# EAGLE design io-serial (EAGLE 5.10)
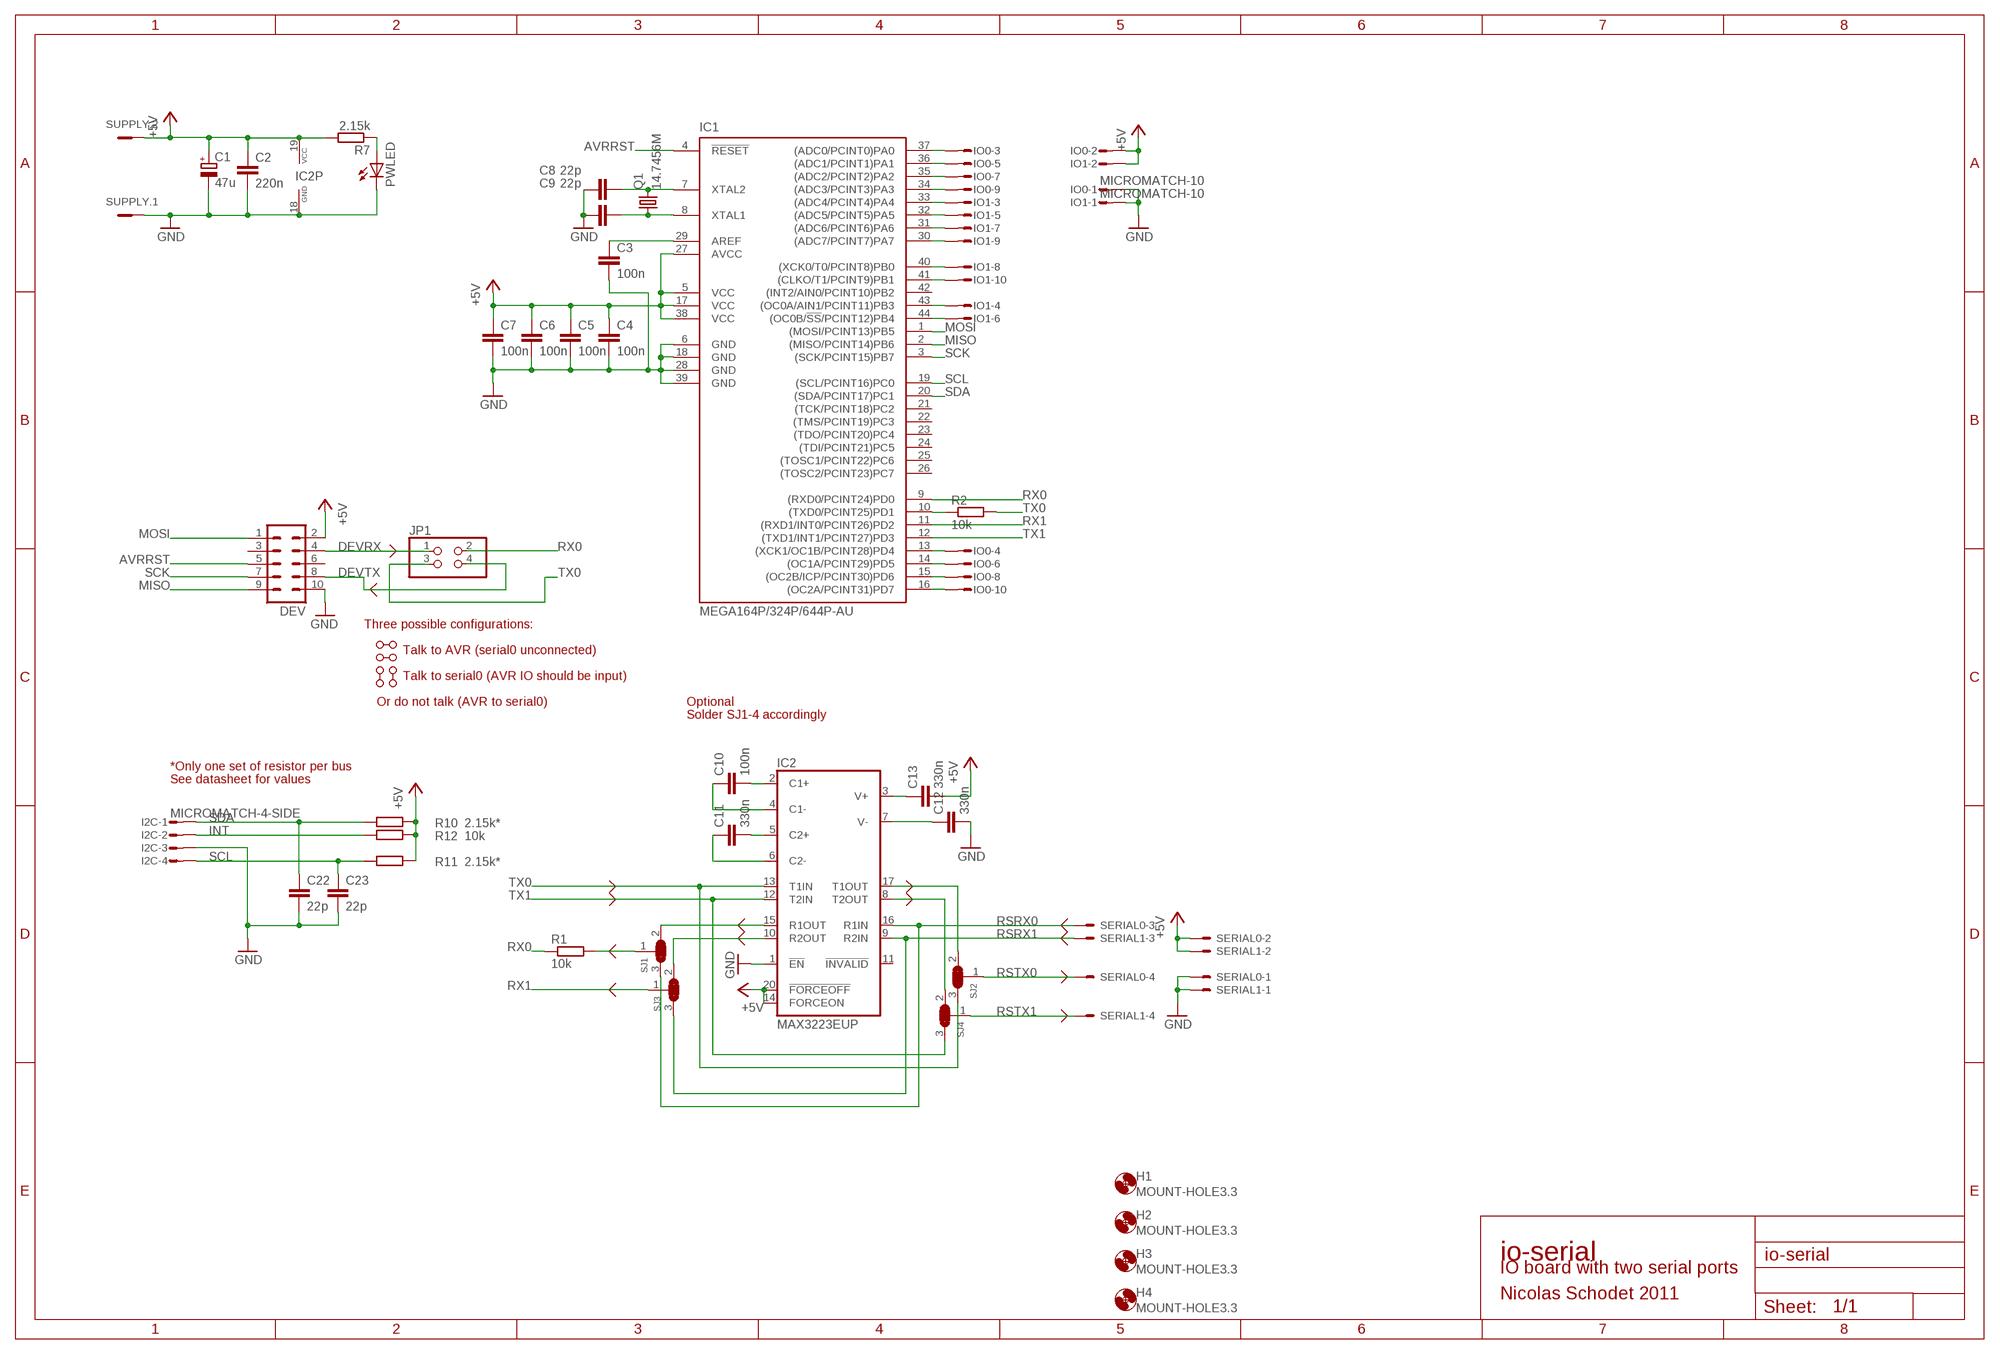
[diagram p0: schematic, sheet 1]

## Parts
C1  47u  CPOL-EUC  [PANASONIC_C]
C2  220n  C-EUC0603  [C0603]
C3  100n  C-EUC0603  [C0603]
C4  100n  C-EUC0603  [C0603]
C5  100n  C-EUC0603  [C0603]
C6  100n  C-EUC0603  [C0603]
C7  100n  C-EUC0603  [C0603]
C8  22p  C-EUC0603  [C0603]
C9  22p  C-EUC0603  [C0603]
C10  100n  C-EUC0603  [C0603]
C11  330n  C-EUC0603  [C0603]
C12  330n  C-EUC0603  [C0603]
C13  330n  C-EUC0603  [C0603]
C22  22p  C-EUC0603  [C0603]
C23  22p  C-EUC0603  [C0603]
DEV  ML10L  [ML10L]
H1  MOUNT-HOLE3.3  [3,3]
H2  MOUNT-HOLE3.3  [3,3]
H3  MOUNT-HOLE3.3  [3,3]
H4  MOUNT-HOLE3.3  [3,3]
I2C  MICROMATCH-4-SIDE  [MICROMATCH-4-SIDE]
IC1  MEGA164P/324P/644P-AU  [TQFP44]
IC2  MAX3223EUP  [TSSOP20]
IO0  MICROMATCH-10  [MICROMATCH-10]
IO1  MICROMATCH-10  [MICROMATCH-10]
JP1  PINHD-2X2  [2X02]
PWLED  LEDSMT1206  [1206]
Q1  14.7456M  CRYSTALHC49U70  [HC49U70]
R1  10k  R-EU_R0603  [R0603]
R2  10k  R-EU_R0603  [R0603]
R7  2.15k  R-EU_R0603  [R0603]
R10  2.15k*  R-EU_R0603  [R0603]
R11  2.15k*  R-EU_R0603  [R0603]
R12  10k  R-EU_R0603  [R0603]
SERIAL0  EC1X04  [EC1X04]
SERIAL1  EC1X04  [EC1X04]
SJ1  SJ2SMD  [SJ2-SMD]
SJ2  SJ2SMD  [SJ2-SMD]
SJ3  SJ2SMD  [SJ2-SMD]
SJ4  SJ2SMD  [SJ2-SMD]
SUPPLY  MC2  [MC2]

## Nets
+5V [supply]: C1.+ C2.1 C4.1 C5.1 C6.1 C7.1 C13.2 DEV.2 IC1.5(VCC) IC1.17(VCC) IC1.27(AVCC) IC1.38(VCC) IC2.14(FORCEON) IC2.19(VCC) IC2.20(!FORCEOFF) IO0.2 IO1.2 R7.2 R10.2 R11.2 R12.2 SERIAL0.2 SERIAL1.2 SUPPLY.2
A0: IC1.37((ADC0/PCINT0)PA0) IO0.3
A1: IC1.36((ADC1/PCINT1)PA1) IO0.5
A2: IC1.35((ADC2/PCINT2)PA2) IO0.7
A3: IC1.34((ADC3/PCINT3)PA3) IO0.9
A4: IC1.33((ADC4/PCINT4)PA4) IO1.3
A5: IC1.32((ADC5/PCINT5)PA5) IO1.5
A6: IC1.31((ADC6/PCINT6)PA6) IO1.7
A7: IC1.30((ADC7/PCINT7)PA7) IO1.9
AREF: C3.1 IC1.29(AREF)
AVRCLK: C8.2 IC1.7(XTAL2) Q1.2
AVRRST: DEV.5 IC1.4(!RESET)
D4: IC1.13((XCK1/OC1B/PCINT28)PD4) IO0.4
D5: IC1.14((OC1A/PCINT29)PD5) IO0.6
D6: IC1.15((OC2B/ICP/PCINT30)PD6) IO0.8
D7: IC1.16((OC2A/PCINT31)PD7) IO0.10
DEVRX: DEV.4 JP1.1
DEVTX: DEV.8 JP1.4
GND [supply]: C1.- C2.2 C3.2 C4.2 C5.2 C6.2 C7.2 C8.1 C9.1 C12.2 C22.2 C23.2 DEV.10 I2C.3 IC1.6(GND) IC1.18(GND) IC1.28(GND) IC1.39(GND) IC2.1(!EN) IC2.18(GND) IO0.1 IO1.1 PWLED.C SERIAL0.1 SERIAL1.1 SUPPLY.1
INT: I2C.2 R12.1
MAXRX0: IC2.15(R1OUT) SJ1.2
MAXRX1: IC2.10(R2OUT) SJ3.2
MAXTX0: IC2.17(T1OUT) SJ2.2
MAXTX1: IC2.8(T2OUT) SJ4.2
MC1+: C10.2 IC2.2(C1+)
MC1-: C10.1 IC2.4(C1-)
MC2+: C11.2 IC2.5(C2+)
MC2-: C11.1 IC2.6(C2-)
MISO: DEV.9 IC1.2((MISO/PCINT14)PB6)
MOSI: DEV.1 IC1.1((MOSI/PCINT13)PB5)
MV+: C13.1 IC2.3(V+)
MV-: C12.1 IC2.7(V-)
NPWLED: PWLED.A R7.1
PB0: IC1.40((XCK0/T0/PCINT8)PB0) IO1.8
PB1: IC1.41((CLKO/T1/PCINT9)PB1) IO1.10
PB3: IC1.43((OC0A/AIN1/PCINT11)PB3) IO1.4
PB4: IC1.44((OC0B/!SS!/PCINT12)PB4) IO1.6
RSRX0: IC2.16(R1IN) SERIAL0.3 SJ1.3
RSRX1: IC2.9(R2IN) SERIAL1.3 SJ3.3
RSTX0: SERIAL0.4 SJ2.1
RSTX1: SERIAL1.4 SJ4.1
RX0: IC1.9((RXD0/PCINT24)PD0) JP1.2 R1.1
RX0R: R1.2 SJ1.1
RX1: IC1.11((RXD1/INT0/PCINT26)PD2) SJ3.1
SCK: DEV.7 IC1.3((SCK/PCINT15)PB7)
SCL: C23.1 I2C.4 IC1.19((SCL/PCINT16)PC0) R11.1
SDA: C22.1 I2C.1 IC1.20((SDA/PCINT17)PC1) R10.1
TX0: IC2.13(T1IN) JP1.3 R2.2 SJ2.3
TX0R: IC1.10((TXD0/PCINT25)PD1) R2.1
TX1: IC1.12((TXD1/INT1/PCINT27)PD3) IC2.12(T2IN) SJ4.3
XTAL1: C9.2 IC1.8(XTAL1) Q1.1
Unconnected: DEV.3 DEV.6 IC1.21((TCK/PCINT18)PC2) IC1.22((TMS/PCINT19)PC3) IC1.23((TDO/PCINT20)PC4) IC1.24((TDI/PCINT21)PC5) IC1.25((TOSC1/PCINT22)PC6) IC1.26((TOSC2/PCINT23)PC7) IC1.42((INT2/AIN0/PCINT10)PB2) IC2.11(!INVALID)

## Notes on the sheet
- Three possible configurations:
- Talk to AVR (serial0 unconnected)
- Talk to serial0 (AVR IO should be input)
- Or do not talk (AVR to serial0) | Optional
- Solder SJ1-4 accordingly
- *Only one set of resistor per bus
- See datasheet for values
- io-serial
- IO board with two serial ports
- Nicolas Schodet 2011

## Library data of the parts
C1 = rcl:CPOL-EU: POLARIZED CAPACITOR, European symbol
C2-C13 C22 C23 = rcl:C-EU: CAPACITOR, European symbol
DEV = con-harting-ml:ML10: HARTING
H1-H4 = holes:MOUNT-HOLE: MOUNTING HOLE with drill center marker
I2C = apbteam_con-amp-micromatch:MICROMATCH-4: MicroMaTch 4
IC1 = avr-5:MEGA164P/324P/644P-AU
IC2 = maxim:MAX3223*: RS-232 Transceivers with AutoShutdown 1µA Supply-Current, True +3V to +5.5V http://dbserv.maxim-ic.com/
IO0 IO1 = apbteam_con-amp-micromatch:MICROMATCH-10: MicroMaTch 10
JP1 = pinhead:PINHD-2X2: PIN HEADER
PWLED = led:LED: LED OSRAM: - CHIPLED LG R971, LG N971, LY N971, LG Q971, LY Q971, LO R971, LY R971 LH N974, LH R974 LS Q976, LO Q976, LY Q976 LO Q996 - Hyper CHIPLED LW Q18S LB Q993, LB Q99A, LB R99A - SideLED LS A670, LO A670, LY A670, LG A670, LP A670 LB A673, LV A673, LT A673, LW A673 LH A674 LY A675 LS A676, LA A676, LO A676, LY A676, LW A676 LS A679, LY A679, LG A679 - Hyper Micro SIDELED® LS Y876, LA Y876, LO Y876, LY Y876 LT Y87S - SmartLED LW L88C, LW L88S LB L89C, LB L89S, LG L890 LS L89K, LO L89K, LY L89K LS L896, LA L896, LO L896, LY L896 - TOPLED LS T670, LO T670, LY T670, LG T670, LP T670 LSG T670, LSP T670, LSY T670, LOP T670, LYG T670 LG T671, LOG T671, LSG T671 LB T673, LV T673, LT T673, LW T673 LH T674 LS T676, LA T676, LO T676, LY T676, LB T676, LH T676, LSB T676, LW T676 LB T67C, LV T67C, LT T67C, LS T67K, LO T67K, LY T67K, LW E67C LS E67B, LA E67B, LO E67B, LY E67B, LB E67C, LV E67C, LT E67C LW T67C LS T679, LY T679, LG T679 LS T770, LO T770, LY T770, LG T770, LP T770 LB T773, LV T773, LT T773, LW T773 LH T774 LS E675, LA E675, LY E675, LS T675 LS T776, LA T776, LO T776, LY T776, LB T776 LHGB T686 LT T68C, LB T68C - Hyper Mini TOPLED® LB M676 - Mini TOPLED Santana® LG M470 LS M47K, LO M47K, LY M47K Source: http://www.osram.convergy.de LUXEON: - LUMILED® LXK2-PW12-R00, LXK2-PW12-S00, LXK2-PW14-U00, LXK2-PW14-V00 LXK2-PM12-R00, LXK2-PM12-S00, LXK2-PM14-U00 LXK2-PE12-Q00, LXK2-PE12-R00, LXK2-PE12-S00, LXK2-PE14-T00, LXK2-PE14-U00 LXK2-PB12-K00, LXK2-PB12-L00, LXK2-PB12-M00, LXK2-PB14-N00, LXK2-PB14-P00, LXK2-PB14-Q00 LXK2-PR12-L00, LXK2-PR12-M00, LXK2-PR14-Q00, LXK2-PR14-R00 LXK2-PD12-Q00, LXK2-PD12-R00, LXK2-PD12-S00 LXK2-PH12-R00, LXK2-PH12-S00 LXK2-PL12-P00, LXK2-PL12-Q00, LXK2-PL12-R00 Source: www.luxeon.com KINGBRIGHT: KA-3528ASYC Source: www.kingbright.com
Q1 = crystal:CRYSTAL: CRYSTAL
R1 R2 R7 R10-R12 = rcl:R-EU_: RESISTOR, European symbol
SERIAL0 SERIAL1 = apbteam_con-amp-he14:E?1X04: Male header simple row, 4 positions
SJ1-SJ4 = apbteam_jumper:SJ2: Jumper, 3 ways
SUPPLY = con-phoenix-381_l:MC2: Mini-Combicon 3.81mm horizontal 2-polig MC 1,5/2-G-3,81 Artikel-Nr. 1803277

## Net classes
1 supply: width 0.254 mm

## Board
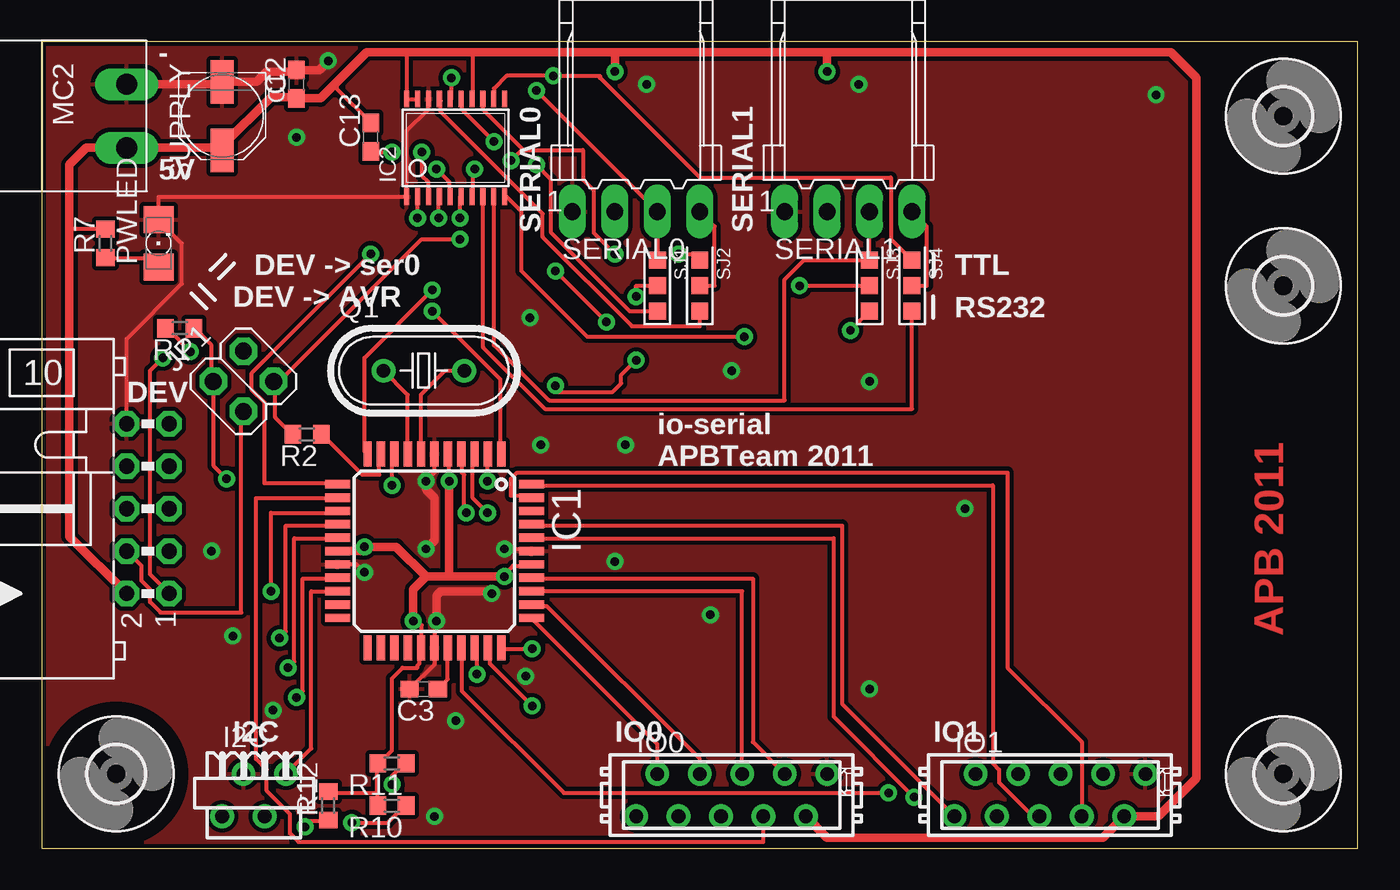
[diagram p1: board, top side]
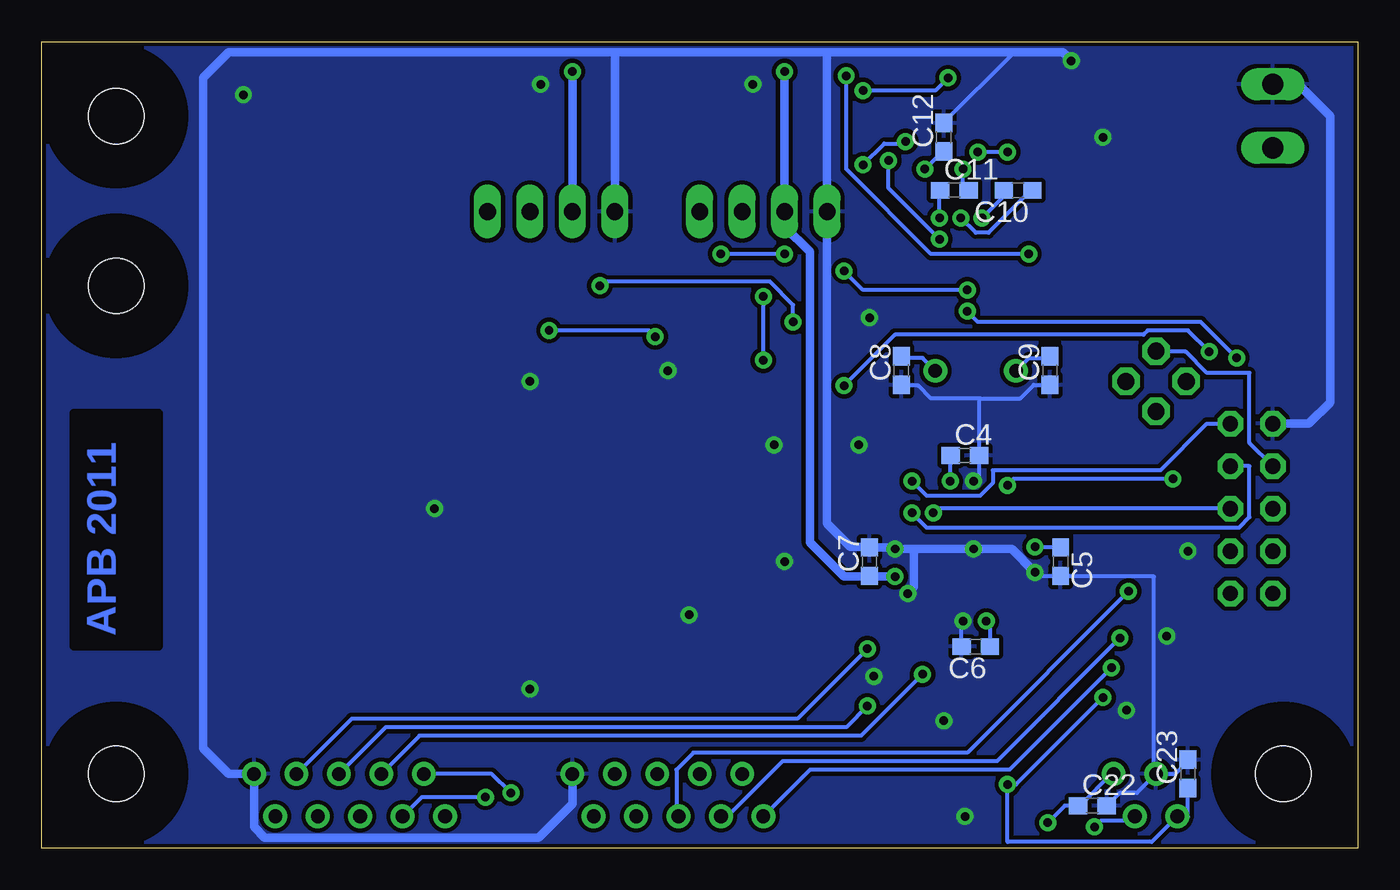
[diagram p2: board, bottom side, seen from below]

Size 78.74 x 48.26 mm. Coordinates in mm from the lower left corner, seen from the top.
Outline: 0,0 78.74,0 78.74,48.26 0,48.26 0,0
Copper layers (1*16): Top 0.035mm / dielectric 1.5mm / Bottom 0.035mm
Design rules "SparkFun *": minimum track width 10mil, minimum drill 20mil, track to track 10mil, track to pad 10mil, pad to pad 10mil, via to via 10mil, smd to smd 10mil, copper to edge 10mil, drill to drill 10mil, minimum pad ring 12mil, minimum via ring 10mil, stop-mask expansion 4mil, vias tented up to drill 25mil, thermal gap 10mil
bRestrict: area 71.8,12.1 to 76.8,26

### Footprints (pad centres in the part's own frame; a part is rotated, then mirrored left to right if it is on the bottom)
PANASONIC_C = smd 2.6 x 1.4: + 2.05,0; - -2.05,0
C0603 = smd 1.1 x 1: 1 -0.85,0; 2 0.85,0
ML10L = drill 0.914 octagon: 1 -5.08,-1.27; 2 -5.08,1.27; 3 -2.54,-1.27; 4 -2.54,1.27; 5 0,-1.27; 6 0,1.27; 7 2.54,-1.27; 8 2.54,1.27; 9 5.08,-1.27; 10 5.08,1.27
3,3 = hole 3.3: 0,0
MICROMATCH-4-SIDE = drill 0.813 round: 1 1.905,1.27; 2 0.635,-1.27; 3 -0.635,1.27; 4 -1.905,-1.27
TQFP44 = smd 1.5 x 0.5: 1 -5.8,4; 2 -5.8,3.2; 3 -5.8,2.4; 4 -5.8,1.6; 5 -5.8,0.8; 6 -5.8,0; 7 -5.8,-0.8; 8 -5.8,-1.6; 9 -5.8,-2.4; 10 -5.8,-3.2; 11 -5.8,-4; 23 5.8,-4; 24 5.8,-3.2; 25 5.8,-2.4; 26 5.8,-1.6; 27 5.8,-0.8; 28 5.8,0; 29 5.8,0.8; 30 5.8,1.6; 31 5.8,2.4; 32 5.8,3.2; 33 5.8,4 | smd 0.5 x 1.5: 12 -4,-5.8; 13 -3.2,-5.8; 14 -2.4,-5.8; 15 -1.6,-5.8; 16 -0.8,-5.8; 17 0,-5.8; 18 0.8,-5.8; 19 1.6,-5.8; 20 2.4,-5.8; 21 3.2,-5.8; 22 4,-5.8; 34 4,5.8; 35 3.2,5.8; 36 2.4,5.8; 37 1.6,5.8; 38 0.8,5.8; 39 0,5.8; 40 -0.8,5.8; 41 -1.6,5.8; 42 -2.4,5.8; 43 -3.2,5.8; 44 -4,5.8
TSSOP20 = smd 0.305 x 0.991: 1 -2.925,-2.918; 2 -2.275,-2.918; 3 -1.625,-2.918; 4 -0.975,-2.918; 5 -0.325,-2.918; 6 0.325,-2.918; 7 0.975,-2.918; 8 1.625,-2.918; 9 2.275,-2.918; 10 2.925,-2.918; 11 2.925,2.918; 12 2.275,2.918; 13 1.625,2.918; 14 0.975,2.918; 15 0.325,2.918; 16 -0.325,2.918; 17 -0.975,2.918; 18 -1.625,2.918; 19 -2.275,2.918; 20 -2.925,2.918
MICROMATCH-10 = drill 0.813 round: 1 5.715,1.27; 2 4.445,-1.27; 3 3.175,1.27; 4 1.905,-1.27; 5 0.635,1.27; 6 -0.635,-1.27; 7 -1.905,1.27; 8 -3.175,-1.27; 9 -4.445,1.27; 10 -5.715,-1.27
2X02 = drill 1.016 octagon: 1 -1.27,-1.27; 2 -1.27,1.27; 3 1.27,-1.27; 4 1.27,1.27
1206 = smd 1.6 x 1.803: A -1.422,0; C 1.422,0
HC49U70 = drill 0.813 round: 1 -2.413,0; 2 2.413,0
R0603 = smd 1 x 1.1: 1 -0.85,0; 2 0.85,0
EC1X04 = drill 1 long: 1 -3.81,0; 2 -1.27,0; 3 1.27,0; 4 3.81,0
SJ2-SMD = smd 1.016 x 1.016: 1 0,0; 2 -1.524,0; 3 1.524,0
MC2 = drill 1.27 long: 1 -1.905,0; 2 1.905,0

### Placement (x,y rotation side)
C1  10.79,43.81 270 top
C2  15.24,45.72 90 top
C3  22.86,9.53 180 top
C4  23.5,23.5 0 bottom
C5  17.78,17.14 270 bottom
C6  22.86,12.06 180 bottom
C7  29.21,17.14 90 bottom
C8  27.3,28.57 90 bottom
C9  18.41,28.57 90 bottom
C10  20.32,39.37 180 bottom
C11  24.13,39.37 0 bottom
C12  24.77,42.55 90 bottom
C13  19.68,42.55 90 top
C22  15.88,2.54 0 bottom
C23  10.16,4.45 90 bottom
DEV  6.35,20.32 90 top
H1  4.45,4.45 0 top
H2  74.3,4.45 0 top
H3  74.3,43.81 0 top
H4  74.3,33.66 0 top
I2C  12.7,3.17 0 top
IC1  23.5,17.78 270 top
IC2  24.77,41.91 0 top
IO0  41.27,3.17 0 top
IO1  60.33,3.17 0 top
JP1  12.06,27.94 45 top
PWLED  6.99,36.2 90 top
Q1  22.86,28.57 0 top
R1  8.26,31.11 180 top
R2  15.88,24.77 180 top
R7  3.81,36.2 90 top
R10  20.95,2.54 180 top
R11  20.95,5.08 180 top
R12  17.14,2.54 90 top
SERIAL0  35.56,38.1 0 top
SERIAL1  48.26,38.1 0 top
SJ1  36.83,33.66 90 top
SJ2  39.37,33.66 90 top
SJ3  49.53,33.66 90 top
SJ4  52.07,33.66 90 top
SUPPLY  5.08,43.81 270 top

### Tracks (layer width: path | path; a pad name or v marks a point on that pad's centre or on a via)
+5V  (via drill 0.51)
  Top 0.254: v24.38,21.97 24.38,23.49 IC1.5 | v27.69,16.26 27.69,16.38 28.19,16.89 29.21,16.89 IC1.38 | v22.23,13.59 22.48,13.59 22.73,13.34 22.73,12.02 IC1.27 22.61,11.94 22.61,11.05 22.48,10.92 22.48,10.79 21.59,10.79 20.95,10.16 20.95,5.84 20.19,5.08 R11.2 20.07,5.08 20.07,3.3 | 20.07,3.3 17.14,3.3 R12.2 | 20.07,3.3 20.07,2.54 R10.2 | IC2.19 22.48,44.83 IC2.20 21.84,44.96 21.84,47.62 | IC2.14 25.78,44.83 25.78,47.62 | R7.2 3.81,37.08 1.65,37.08 | C13.2 19.68,43.43 17.65,45.47 17.65,45.59 17.53,45.72
  Top 0.508: DEV.2 1.65,18.67 1.65,37.08 1.65,40.89 2.67,41.91 SUPPLY.2 10.65,41.91 C1.+ 10.79,42.04 13.72,44.96 15.15,44.96 C2.1 16.68,44.87 17.53,45.72 19.43,47.62 21.84,47.62 25.78,47.62 34.29,47.62 | IC1.17 19.05,17.78 v19.3,18.03 21.21,18.03 22.99,16.26 | 24.38,16.26 v24.38,21.97 | 24.38,16.26 v27.69,16.26 | 22.99,16.26 24.38,16.26 | 22.99,16.26 22.23,15.49 v22.23,13.59 | 34.29,47.62 46.99,47.62 | 46.99,47.62 67.56,47.62 69.09,46.1 69.09,4.19 66.8,1.91 IO1.2 63.5,0.64 46.99,0.64 IO0.2 | 46.99,47.62 v46.99,46.48 | v34.29,46.48 34.29,47.62
  Bottom 0.254: C4.1 24.34,23.53 IC1.5 24.3,23.08 24.38,22.99 v24.38,21.97 | 29.12,16.3 C7.1 | C6.1 22.01,13.37 v22.23,13.59 | v19.3,18.03 17.82,18.03 C5.1
  Bottom 0.508: 29.12,16.3 29.08,16.26 v27.69,16.26 | C7.1 29.25,16.26 30.73,16.26 32.77,18.29 32.77,35.69 34.29,37.21 SERIAL0.2 v34.29,46.48 | v46.99,46.48 SERIAL1.2
A0
  Top 0.254: IO0.3 42.55,6.35 42.55,16.13 29.34,16.13 IC1.37
A1
  Top 0.254: IO0.5 41.91,15.37 29.34,15.37 IC1.36
A2
  Top 0.254: IO0.7 39.37,5.33 30.23,14.48 29.34,14.48 IC1.35
A3
  Top 0.254: IO0.9 36.83,6.22 30.23,12.83 29.34,13.72 IC1.34
A4  (via drill 0.51)
  Top 0.254: v29.34,11.94 27.56,11.94 IC1.33
  Bottom 0.254: v29.34,11.94 33.53,7.75 60.2,7.75 IO1.3
A5  (via drill 0.51)
  Top 0.254: v29.34,8.51 26.8,11.05 26.8,11.94 IC1.32
  Bottom 0.254: v29.34,8.51 30.61,7.24 58.17,7.24 IO1.5
A6  (via drill 0.51)
  Top 0.254: v26.04,10.41 26.04,11.81 25.91,11.94 IC1.31
  Bottom 0.254: v26.04,10.41 29.72,6.73 56.13,6.73 IO1.7
A7  (via drill 0.51)
  Top 0.254: v50.67,3.3 31.24,3.3 25.15,9.4 25.15,11.94 IC1.30
  Bottom 0.254: v50.67,3.3 51.82,4.45 IO1.9
AREF
  Top 0.254: IC1.29 24.3,10.11 C3.1
AVRCLK
  Top 0.254: IC1.7 22.7,27.14 24.13,28.57 Q1.2
  Bottom 0.254: Q1.2 26.04,29.34 27.22,29.34 C8.2
AVRRST  (via drill 0.51)
  Top 0.254: v25.4,20.07 25.27,20.19 25.27,22.35 25.15,22.48 25.15,23.5 IC1.4
  Bottom 0.254: v25.4,20.07 25.15,20.32 DEV.5
D4
  Top 0.254: IO0.4 43.18,0.38 15.37,0.38 14.86,0.89 14.86,2.03 13.46,3.43 13.46,4.7 12.83,5.33 12.83,20.95 17.65,20.95 IC1.13
D5  (via drill 0.51)
  Top 0.254: v13.72,15.37 13.72,20.07 17.65,20.07 IC1.14
  Bottom 0.254: v13.72,15.37 23.37,5.71 39.75,5.71 40.77,4.7 40.77,1.91 IO0.6
D6  (via drill 0.51)
  Top 0.254: v14.22,12.57 14.61,12.95 14.61,19.3 17.65,19.3 IC1.15
  Bottom 0.254: v14.22,12.57 21.59,5.21 34.42,5.21 37.72,1.91 IO0.8
D7  (via drill 0.51)
  Top 0.254: v14.73,10.79 15.11,11.18 15.11,18.54 17.65,18.54 IC1.16
  Bottom 0.254: v14.73,10.79 20.83,4.7 32.77,4.7 IO0.10
DEVRX
  Top 0.254: DEV.4 5.97,16.89 5.97,16 6.48,15.49 6.48,14.73 7.11,14.1 11.94,14.1 11.94,26.04 JP1.1
DEVTX
  Bottom 0.254: DEV.8 6.48,24.26 6.48,28.45 9.02,28.45 10.29,29.72 12.06,29.72 JP1.4
GND  (via drill 0.51)
  Top 0.254: v22.99,21.97 23.5,22.48 IC1.6 | v27.69,17.91 29.17,17.91 IC1.39 | C3.2 23.5,11.01 IC1.28 23.5,13.46 v23.62,13.59 | IC1.18 18.83,16.98 v19.3,16.51 | IC2.18 23.11,44.7 23.11,44.2 21.84,42.93 21.84,39.12 IC2.1 21.72,38.99 6.99,38.99 PWLED.C 6.99,37.59 8.38,36.2 8.38,33.78 5.08,30.48 DEV.10
  Top 0.508: SUPPLY.1 10.65,45.72 C1.- 12.85,45.87 13.46,46.48 15.15,46.48 C2.2 16.6,46.57 v17.14,47.12 | v22.99,17.91 23.5,18.41 23.5,20.95 22.99,21.46 v22.99,21.97 | v26.92,15.24 26.8,15.37 23.88,15.37 23.62,15.11 v23.62,13.59
  Bottom 0.254: C9.1 19.39,27.73 20.19,26.92 22.61,26.92 | 22.61,26.92 25.53,26.92 26.29,27.69 27.27,27.69 C8.1 | 22.61,26.92 22.64,26.89 C4.2 22.64,22.31 v22.99,21.97 | v23.62,13.59 23.75,13.46 23.75,12.1 C6.2 | v19.3,16.51 19.05,16.26 17.82,16.26 C5.2 17.78,16.26 12.19,16.26 12.19,4.45 I2C.3 | I2C.3 10.92,4.45 10.16,5.21 C23.2 | I2C.3 13.21,3.3 14.22,3.3 14.99,2.54 C22.2 | C12.2 24.77,43.43 20.7,47.5 20.7,47.62
  Bottom 0.508: SUPPLY.1 3.56,45.72 1.65,43.81 1.65,26.67 2.92,25.4 DEV.10 | v17.14,47.12 17.65,47.62 20.7,47.62 31.75,47.62 | 31.75,47.62 44.45,47.62 | 44.45,47.62 SERIAL1.1 | 31.75,47.62 SERIAL0.1 31.75,19.43 30.35,18.03 29.25,18.03 C7.2 27.77,18 v27.69,17.91 26.54,17.91 | 44.45,47.62 67.56,47.62 69.09,46.1 69.09,5.97 67.56,4.45 IO1.1 66.04,1.27 65.41,0.64 49.02,0.64 46.99,2.67 IO0.1 | 22.86,17.91 26.54,17.91 | 22.86,17.91 20.7,17.91 v19.3,16.51 | v22.99,17.91 22.99,18.03 22.86,17.91 | 26.54,17.91 26.54,15.62 v26.92,15.24
  other vias: 66.67,45.09 36.2,45.72 48.9,45.72 29.84,24.13 34.92,24.13 49.53,27.94 29.21,31.75 41.27,28.57 55.24,20.32 49.53,9.53 40.01,13.97 34.29,17.14 24.77,7.62 23.5,1.91 11.43,12.7 10.16,17.78 15.24,42.55 28.96,10.29 13.84,8.26
  pour Bottom (isolate 0.254): 0,48.26 78.74,48.26 78.74,0 0,0
  pour Top (isolate 0.254): 0,48.26 78.74,48.26 78.74,0 0,0
INT  (via drill 0.51)
  Top 0.254: v15.75,1.27 15.75,1.65 17.14,1.65 R12.1
  Bottom 0.254: v15.75,1.27 15.37,1.65 13.59,1.65 I2C.2
MAXRX0  (via drill 0.51)
  Top 0.254: v27.05,42.29 25.15,44.2 25.15,44.7 IC2.15 | v29.59,40.89 30.48,40.01 30.48,36.83 35.18,32.13 SJ1.2
  Bottom 0.254: v27.05,42.29 27.18,42.16 28.32,42.16 v29.59,40.89
MAXRX1  (via drill 0.51)
  Top 0.254: v42.04,30.61 32.64,30.61 28.7,34.54 28.7,38.1 27.81,38.99 IC2.10 | v48.39,30.99 SJ3.2
  Bottom 0.254: v42.04,30.61 42.42,30.99 v48.39,30.99
MAXTX0
  Top 0.254: SJ2.2 39.37,31.24 35.31,31.24 29.97,36.58 29.97,37.97 23.88,44.07 23.88,44.7 IC2.17
MAXTX1
  Top 0.254: SJ4.2 52.07,26.29 30.1,26.29 26.42,29.97 26.42,38.99 IC2.8
MC1+  (via drill 0.51)
  Top 0.254: v22.48,37.72 22.48,38.99 IC2.2
  Bottom 0.254: v22.48,37.72 21.21,38.99 21.21,39.37 C10.2
MC1-  (via drill 0.51)
  Top 0.254: v23.75,37.72 23.75,38.99 IC2.4
  Bottom 0.254: v23.75,37.72 22.86,36.83 22.1,36.83 19.56,39.37 C10.1
MC2+  (via drill 0.51)
  Top 0.254: v23.62,40.64 24.38,39.88 24.38,39.12 IC2.5
  Bottom 0.254: v23.62,40.64 23.62,39.37 C11.2
MC2-  (via drill 0.51)
  Top 0.254: v25.02,37.72 25.02,38.99 IC2.6
  Bottom 0.254: v25.02,37.72 25.02,39.37 C11.1
MISO  (via drill 0.51)
  Top 0.254: v26.67,21.97 26.67,23.5 IC1.2
  Bottom 0.254: v26.67,21.97 25.78,21.08 22.61,21.08 21.84,21.84 21.84,22.61 11.81,22.61 9.02,25.4 DEV.9
MOSI  (via drill 0.51)
  Top 0.254: v23.37,32.13 27.43,28.07 27.43,23.62 IC1.1 | v7.24,29.34 6.48,28.57 6.48,16.38 DEV.1
  Bottom 0.254: v23.37,32.13 22.73,31.5 9.4,31.5 v7.24,29.34
MV+  (via drill 0.51)
  Top 0.254: v22.73,41.66 22.73,40.26 23.11,39.88 23.11,39.12 IC2.3 | v20.95,41.66 19.68,41.66 C13.1
  Bottom 0.254: v20.95,41.66 v22.73,41.66
MV-  (via drill 0.51)
  Top 0.254: v25.91,40.64 25.78,40.51 25.78,39.12 IC2.7
  Bottom 0.254: v25.91,40.64 24.89,41.66 24.77,41.66 C12.1
NPWLED
  Top 0.254: R7.1 3.81,35.31 6.99,35.31 PWLED.A
PB0  (via drill 0.51)
  Top 0.254: v52.2,3.05 47.37,7.87 47.37,18.54 29.34,18.54 IC1.40
  Bottom 0.254: v52.2,3.05 56.01,3.05 IO1.8
PB1
  Top 0.254: IO1.10 47.88,8.64 47.88,19.3 29.34,19.3 IC1.41
PB3
  Top 0.254: IO1.4 62.23,6.35 57.78,10.79 57.78,22.48 28.45,22.48 28.07,22.1 28.07,21.08 29.21,21.08 IC1.43
PB4
  Top 0.254: IO1.6 59.31,1.91 57.28,3.94 57.28,4.7 56.9,5.08 56.9,21.72 29.34,21.72 IC1.44
RSRX0  (via drill 0.51)
  Top 0.254: SJ1.3 SERIAL0.3 v29.59,45.34 | v24.51,46.1 24.51,44.83 IC2.16
  Bottom 0.254: v24.51,46.1 25.27,45.34 v29.59,45.34
RSRX1
  Top 0.254: IC2.9 27.05,30.1 30.35,26.8 44.45,26.8 44.45,34.04 45.59,35.18 SJ3.3 SERIAL1.3
RSTX0
  Top 0.254: SJ2.1 40.26,33.66 40.26,37.21 SERIAL0.4
RSTX1
  Top 0.254: SJ4.1 52.96,33.66 52.96,37.21 SERIAL1.4
RX0  (via drill 0.51)
  Top 0.254: R1.1 9.14,31.11 10.16,30.1 10.16,27.94 JP1.2 10.29,27.94 10.29,22.86 v11.05,22.1 | v20.95,21.72 20.95,23.37 21.08,23.5 IC1.9
  Bottom 0.254: v20.95,21.72 20.57,22.1 v11.05,22.1
RX0R  (via drill 0.51)
  Top 0.254: SJ1.1 35.56,33.66 v35.56,33.02 | v35.56,29.21 34.67,28.32 34.67,27.81 34.16,27.3 30.73,27.3 v30.73,27.69 | v8.89,29.72 7.49,31.11 R1.2
  Bottom 0.254: v35.56,29.21 v35.56,33.02 | v30.73,27.69 27.69,30.73 12.83,30.73 12.57,30.99 10.16,30.99 v8.89,29.72
RX1  (via drill 0.51)
  Top 0.254: v45.34,33.66 SJ3.1 | v30.73,34.54 v33.78,31.5 | v23.37,33.4 19.3,29.34 19.3,23.75 19.43,23.62 IC1.11
  Bottom 0.254: v45.34,33.66 45.09,33.91 35.18,33.91 33.78,32.51 v33.78,31.5 | v30.73,34.54 29.59,33.4 v23.37,33.4
SCK  (via drill 0.51)
  Top 0.254: v26.67,20.07 25.78,20.95 25.78,23.5 IC1.3
  Bottom 0.254: v26.67,20.07 25.78,19.18 7.11,19.18 6.48,19.81 6.48,22.86 DEV.7
SCL  (via drill 0.51)
  Top 0.254: v20.95,3.81 20.95,4.32 21.72,5.08 R11.1 | v15.24,9.02 15.62,9.4 15.62,16.13 17.65,16.13 IC1.19
  Bottom 0.254: C23.1 10.16,1.91 I2C.4 12.32,0.38 20.95,0.38 v20.95,3.81 20.45,3.81 v15.24,9.02
SDA  (via drill 0.51)
  Top 0.254: v18.54,1.52 20.7,1.52 21.72,2.54 R10.1 | I2C.1 16.13,5.97 16.13,15.37 17.65,15.37 IC1.20
  Bottom 0.254: I2C.1 14.73,4.45 16.64,2.54 C22.1 17.53,2.54 v18.54,1.52
TX0  (via drill 0.51)
  Top 0.254: R2.2 14.99,24.77 13.97,25.78 13.97,27.81 JP1.3 14.1,27.81 22.73,36.45 v25.02,36.45 | 28.77,41.85 28.83,41.78 32.38,41.78 32.38,40.01 33.02,39.37 33.02,36.83 v34.29,35.56 | 28.77,41.85 26.42,44.2 26.42,44.7 IC2.13 | v38.1,35.56 39.37,35.56 SJ2.3 | v28.07,41.15 28.77,41.85
  Bottom 0.254: v34.29,35.56 v38.1,35.56 | v25.02,36.45 28.07,39.5 v28.07,41.15
TX0R
  Top 0.254: R2.1 16.76,24.77 19.18,22.35 20.19,22.35 20.19,23.5 IC1.10
TX1  (via drill 0.51)
  Top 0.254: SJ4.3 50.8,36.45 50.8,40.13 39.37,40.13 33.4,46.1 33.4,46.23 v30.61,46.23 27.81,46.23 27.05,45.47 IC2.12 | v19.68,35.56 12.57,28.45 12.57,27.43 13.34,26.67 13.34,21.84 17.65,21.84 IC1.12
  Bottom 0.254: v19.68,35.56 25.53,35.56 30.61,40.64 v30.61,46.23
XTAL1
  Top 0.254: IC1.8 21.89,27.13 Q1.1
  Bottom 0.254: C9.2 18.26,29.21 | Q1.1 19.68,29.34 18.5,29.34
  Bottom 0.406: 18.5,29.34 C9.2

### Text on the board
Top: APB 2011
Bottom: APB 2011
tSilk: - | 5V | SERIAL0 | SERIAL1 | DEV -> ser0 | TTL | DEV -> AVR | RS232 | DEV | io-serial | APBTeam 2011 | I2C | IO0 | IO1